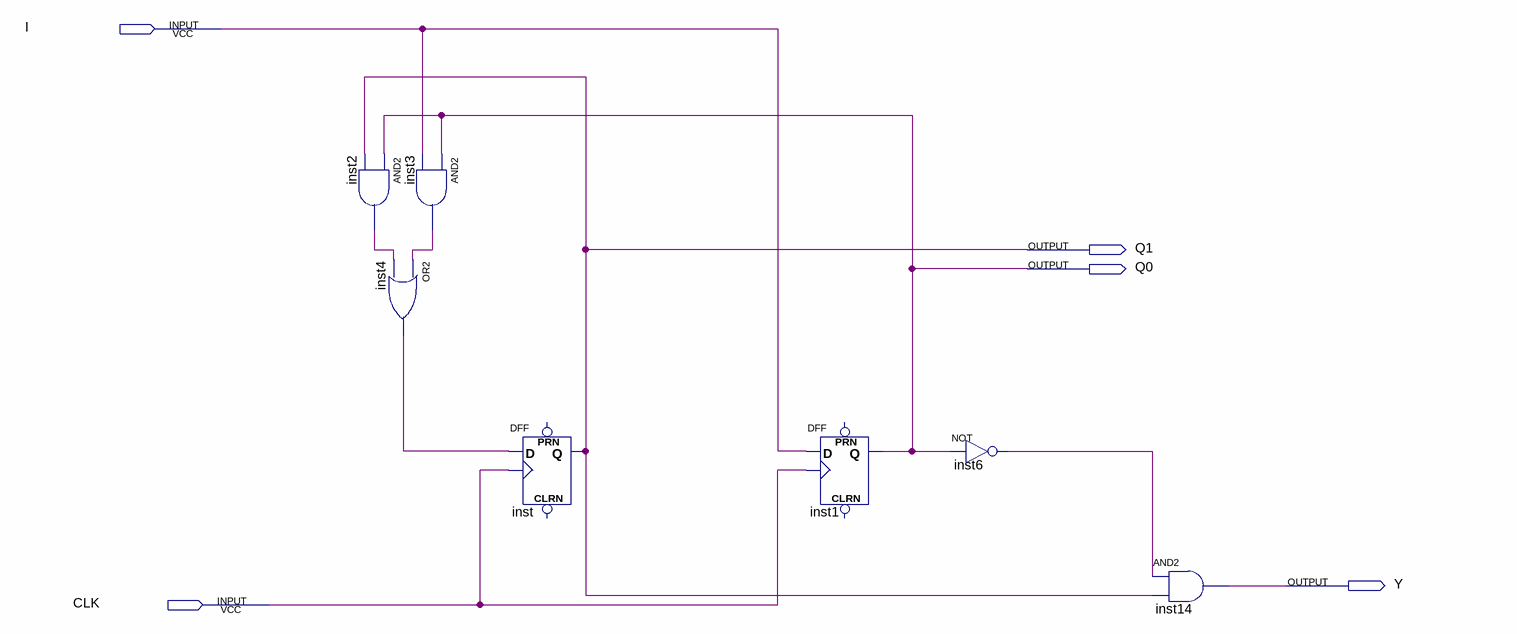
[diagram p0: schematic sheet]
// Quartus schematic Lap02.bdf as structural Verilog: 7 symbols, 5 pins
module Lap02 (
  input  I,
  input  CLK,
  output Q1,
  output Q0,
  output Y
);

  wire inst2_out, inst3_out, inst4_out, inst6_out;

  and inst2 (inst2_out, Q0, Q1);
  or inst4 (inst4_out, inst3_out, inst2_out);
  and inst3 (inst3_out, Q0, I);
  DFF inst (.CLK(CLK), .D(inst4_out), .Q(Q1));  // open: CLRN, PRN
  DFF inst1 (.CLK(CLK), .D(I), .Q(Q0));  // open: CLRN, PRN
  not inst6 (inst6_out, Q0);
  and inst14 (Y, inst6_out, Q1);
endmodule
